# EasyEDA Pro project ProPrj_3x3motors_2025-05-25.epro, schematic gyro_sens
Create Date: 2025-05-12; Page Name: P1; Project Name: 3x3motors; Schematic Name: gyro_sens; Update Date: 2025-05-21; Company: EasyEDA.com; Page Size: A4; Version: V1.0
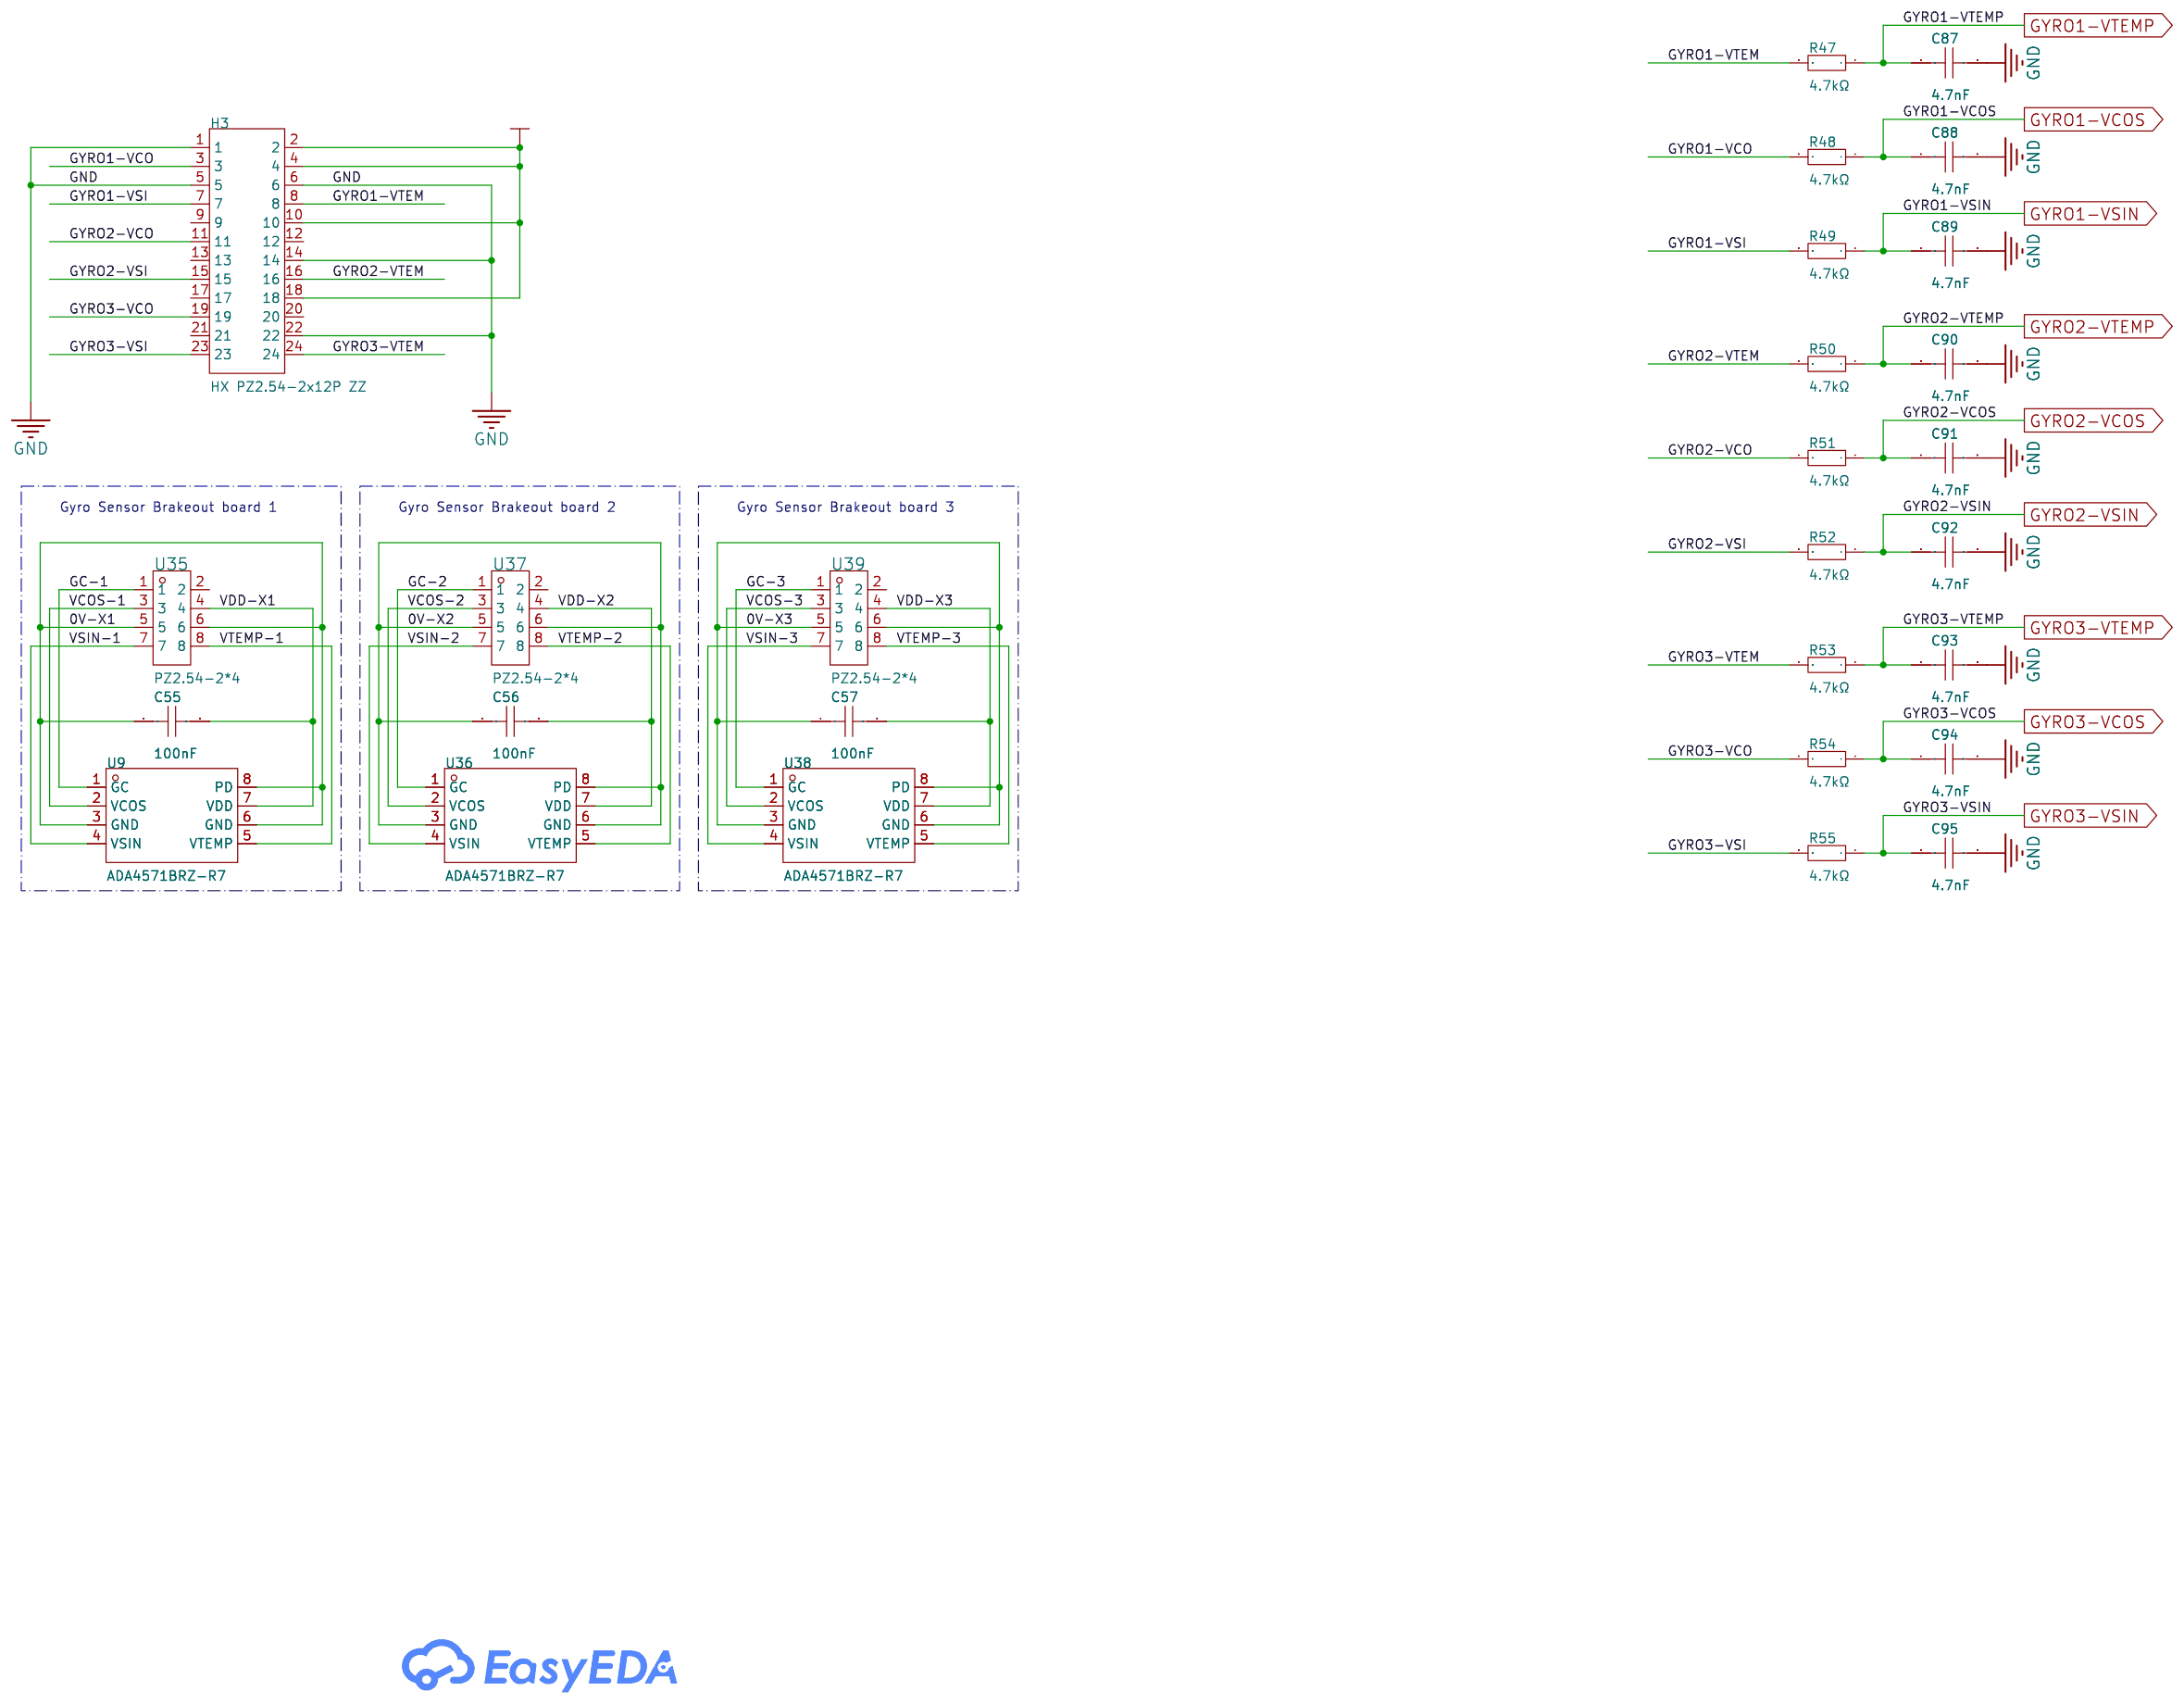
[diagram p1: schematic sheet]

## Parts
C55  100nF  [C0402]
C56  100nF  [C0402]
C57  100nF  [C0402]  (no BOM)
C87  4.7nF  [C0402]
C88  4.7nF  [C0402]
C89  4.7nF  [C0402]
C90  4.7nF  [C0402]
C91  4.7nF  [C0402]
C92  4.7nF  [C0402]
C93  4.7nF  [C0402]
C94  4.7nF  [C0402]
C95  4.7nF  [C0402]
H3  HX PZ2.54-2x12P ZZ  [HDR-TH_24P-P2.54-V-M-R2-C12-S2.54]  (no BOM)
R47  4.7kΩ  [R0402]
R48  4.7kΩ  [R0402]
R49  4.7kΩ  [R0402]
R50  4.7kΩ  [R0402]
R51  4.7kΩ  [R0402]
R52  4.7kΩ  [R0402]
R53  4.7kΩ  [R0402]
R54  4.7kΩ  [R0402]
R55  4.7kΩ  [R0402]
U9  ADA4571BRZ-R7  [SOIC-8_L4.9-W3.9-P1.27-LS6.0-BL]
U35  PZ2.54-2*4  [HDR-TH_8P-P2.54-V-M-R2-C4-S2.54]
U36  ADA4571BRZ-R7  [SOIC-8_L4.9-W3.9-P1.27-LS6.0-BL]
U37  PZ2.54-2*4  [HDR-TH_8P-P2.54-V-M-R2-C4-S2.54]
U38  ADA4571BRZ-R7  [SOIC-8_L4.9-W3.9-P1.27-LS6.0-BL]  (no BOM)
U39  PZ2.54-2*4  [HDR-TH_8P-P2.54-V-M-R2-C4-S2.54]  (no BOM)

## Library data of the parts
C55-C57 = CL05B104KB54PNC: Capacitance: Tolerance:±10% Tolerance:±10% Voltage Rated: Temperature Coefficient:; LCSC Part Name: 100nF ±10% 50V; Supplier Part: C307331; Manufacturer: SAMSUNG(三星); Supplier Footprint: 0402; JLCPCB Part Class: Basic Part; Datasheet: https://atta.szlcsc.com/upload/public/pdf/source/20160218/1457707763339.pdf; Supplier: LCSC; Tolerance: ±10%; Check: true
C87-C95 = 0402B472K500NT: Capacitance:4.7nF Tolerance:±10% Tolerance:±10% Voltage Rating:50V Temperature Coefficient:X7R; LCSC Part Name: 4.7nF ±10% 50V; Supplier Part: C1538; Manufacturer: FH(风华); Supplier Footprint: 0402; JLCPCB Part Class: Basic Part; Datasheet: https://atta.szlcsc.com/upload/public/pdf/source/20200305/C486355_26A10D38EF8C2A5C37091D0039909270.pdf; Supplier: LCSC; Tolerance: ±10%; Voltage Rating: 50V; Temperature Coefficient: X7R
H3 = HX PZ2.54-2x12P ZZ: Pin Structure:2x12P Pitch:2.54mm Row Spacing:2.54mm Circluar Pins/Square Pins:Policy Number of Rows:Double Row Number of Pins:24P Current Rating:3A Length of Mating Pin:6mm Insulation Height:2.5mm Length of End Connection Pin:3mm Contact Plating:Gold Oper; LCSC Part Name: 间距:2.54mm 2x12P 直针; Supplier Part: C42372520; Manufacturer: hanxia(韩下); Supplier Footprint: 插件,P=2.54mm; Datasheet: https://atta.szlcsc.com/upload/public/pdf/source/20241030/FABA9924355EF3ED6720AD656562B1EA.pdf; Supplier: LCSC; Pin Structure: 2x12P; Pitch: 2.54mm; Row Spacing: 2.54mm; Circluar Pins/Square Pins: Policy; Number of Rows: Double Row; Number of Pins: 24P; Current Rating: 3A; Length of Mating Pin: 6mm; Insulation Height: 2.5mm; Length of End Connection Pin: 3mm; Contact Plating: Gold; Operating Temperature: -40℃~+105℃; Color: Black; Check: true
R47-R55 = 0402WGF4701TCE: Type:Thick Film Resistors Resistance:4.7kΩ Tolerance:±1% Tolerance:±1% Power(Watts): Overload Voltage (Max): Temperature Coefficient:±100ppm/℃ Temperature Coefficient:±100ppm/℃ Operating Temperature Range:-55℃~+155℃ Operating Temperature Range:-55℃~+155℃; LCSC Part Name: 4.7kΩ ±1% 62.5mW 厚膜电阻; Supplier Part: C25900; Manufacturer: UNI-ROYAL(厚声); Supplier Footprint: 0402; JLCPCB Part Class: Basic Part; Datasheet: https://atta.szlcsc.com/upload/public/pdf/source/20200306/C422600_1E6D84923E4A46A82E41ADD87F860B5C.pdf; Supplier: LCSC; Type: Thick Film Resistors; Tolerance: ±1%; Temperature Coefficient: ±100ppm/℃; Operating Temperature Range: -55℃~+155℃
U9 U36 U38 = ADA4571BRZ-R7: Supply Voltage:2.7V~5.5V Supply Voltage:2.7V~5.5V Rotation Angle:180° Rotation Angle:180°; LCSC Part Name: 集成式AMR角度传感器和信号调节器; Supplier Part: C654133; Manufacturer: ADI(亚德诺); Supplier Footprint: SOIC-8; JLCPCB Part Class: Extended Part; Datasheet: https://atta.szlcsc.com/upload/public/pdf/source/20220519/62AB8C0A17FC2699D9F7EA79DD50A03D.pdf; Supplier: LCSC; Supply Voltage: 2.7V~5.5V; Rotation Angle: 180°; Check: true
U35 U37 U39 = PZ2.54-2*4: Pin Structure:2x4P Pitch:2.54mm Number of Rows:双排 Number of Pins:8P; Supplier Part: C5156676; Manufacturer: ZHOURI(洲日); Supplier Footprint: 插件,P=2.54mm; JLCPCB Part Class: Extended Part; Datasheet: https://atta.szlcsc.com/upload/public/pdf/source/20220923/0E7A4A94740FFD503E2D73F36F92C1EA.pdf; Supplier: LCSC; Pin Structure: 2x4P; Pitch: 2.54mm; Number of Rows: 双排; Number of Pins: 8P; Check: true

## Nets
0V-X1: C55.1 U9.3(GND) U9.6(GND) U9.8(PD) U35.5 U35.6
0V-X2: C56.1 U36.3(GND) U36.6(GND) U36.8(PD) U37.5 U37.6
0V-X3: C57.1 U38.3(GND) U38.6(GND) U38.8(PD) U39.5 U39.6
3.3V: H3.2 H3.4 H3.10 H3.18
GND: C87.2 C88.2 C89.2 C90.2 C91.2 C92.2 C93.2 C94.2 C95.2 H3.1 H3.5 H3.6 H3.14 H3.22
VDD-X1: C55.2 U9.7(VDD) U35.4
VDD-X2: C56.2 U36.7(VDD) U37.4
VDD-X3: C57.2 U38.7(VDD) U39.4
GC-1: U9.1(GC) U35.1
GC-2: U36.1(GC) U37.1
GC-3: U38.1(GC) U39.1
GYRO1-VCO: H3.3 R48.2
GYRO1-VCOS: C88.1 R48.1
GYRO1-VSI: H3.7 R49.2
GYRO1-VSIN: C89.1 R49.1
GYRO1-VTEM: H3.8 R47.2
GYRO1-VTEMP: C87.1 R47.1
GYRO2-VCO: H3.11 R51.2
GYRO2-VCOS: C91.1 R51.1
GYRO2-VSI: H3.15 R52.2
GYRO2-VSIN: C92.1 R52.1
GYRO2-VTEM: H3.16 R50.2
GYRO2-VTEMP: C90.1 R50.1
GYRO3-VCO: H3.19 R54.2
GYRO3-VCOS: C94.1 R54.1
GYRO3-VSI: H3.23 R55.2
GYRO3-VSIN: C95.1 R55.1
GYRO3-VTEM: H3.24 R53.2
GYRO3-VTEMP: C93.1 R53.1
VCOS-1: U9.2(VCOS) U35.3
VCOS-2: U36.2(VCOS) U37.3
VCOS-3: U38.2(VCOS) U39.3
VSIN-1: U9.4(VSIN) U35.7
VSIN-2: U36.4(VSIN) U37.7
VSIN-3: U38.4(VSIN) U39.7
VTEMP-1: U9.5(VTEMP) U35.8
VTEMP-2: U36.5(VTEMP) U37.8
VTEMP-3: U38.5(VTEMP) U39.8

Not connected (* = marked no-connect by the designer): H3 9 12 13 17 20 21; U35 2; U37 2; U39 2

## Notes on the sheet
- Gyro Sensor Brakeout board 1
- Gyro Sensor Brakeout board 2
- Gyro Sensor Brakeout board 3
